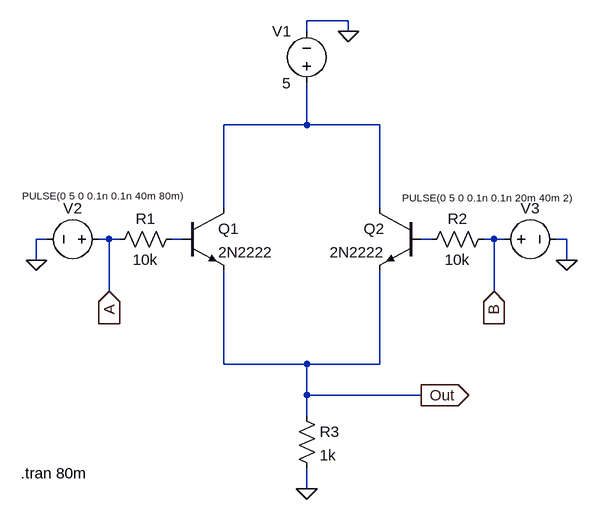
[diagram p0: schematic or_gate.asc]
or_gate.asc, the LTspice schematic file:
Version 4
SHEET 1 1080 680
WIRE 544 -256 480 -256
WIRE 480 -240 480 -256
WIRE 544 -240 544 -256
WIRE 480 -96 480 -160
WIRE 480 -96 352 -96
WIRE 592 -96 480 -96
WIRE 352 32 352 -96
WIRE 592 32 592 -96
WIRE 80 80 64 80
WIRE 176 80 160 80
WIRE 192 80 176 80
WIRE 288 80 272 80
WIRE 672 80 656 80
WIRE 768 80 752 80
WIRE 784 80 768 80
WIRE 880 80 864 80
WIRE 64 112 64 80
WIRE 880 112 880 80
WIRE 176 160 176 80
WIRE 768 160 768 80
WIRE 352 272 352 128
WIRE 480 272 352 272
WIRE 592 272 592 128
WIRE 592 272 480 272
WIRE 480 320 480 272
WIRE 656 320 480 320
WIRE 480 352 480 320
WIRE 480 464 480 432
FLAG 480 464 0
FLAG 544 -240 0
FLAG 64 112 0
FLAG 880 112 0
FLAG 656 320 Out
IOPIN 656 320 Out
FLAG 176 160 A
IOPIN 176 160 In
FLAG 768 160 B
IOPIN 768 160 In
SYMBOL npn 288 32 R0
SYMATTR InstName Q1
SYMATTR Value 2N2222
SYMBOL npn 656 32 M0
SYMATTR InstName Q2
SYMATTR Value 2N2222
SYMBOL voltage 480 -144 R180
WINDOW 0 24 96 Left 2
WINDOW 3 24 16 Left 2
WINDOW 123 0 0 Left 0
WINDOW 39 0 0 Left 0
SYMATTR InstName V1
SYMATTR Value 5
SYMBOL res 288 64 R90
WINDOW 0 0 56 VBottom 2
WINDOW 3 32 56 VTop 2
SYMATTR InstName R1
SYMATTR Value 10k
SYMBOL res 768 64 R90
WINDOW 0 0 56 VBottom 2
WINDOW 3 32 56 VTop 2
SYMATTR InstName R2
SYMATTR Value 10k
SYMBOL voltage 176 80 R90
WINDOW 0 -32 56 VBottom 2
WINDOW 3 -77 12 VTop 1
WINDOW 123 0 0 Left 0
WINDOW 39 0 0 Left 0
SYMATTR InstName V2
SYMATTR Value PULSE(0 5 0 0.1n 0.1n 40m 80m)
SYMBOL voltage 768 80 M90
WINDOW 0 -32 56 VBottom 2
WINDOW 3 -74 -13 VTop 1
WINDOW 123 0 0 Left 0
WINDOW 39 0 0 Left 0
SYMATTR InstName V3
SYMATTR Value PULSE(0 5 0 0.1n 0.1n 20m 40m 2)
SYMBOL res 464 336 R0
SYMATTR InstName R3
SYMATTR Value 1k
TEXT 40 440 Left 2 !.tran 80m

The netlist it stands for:
* or_gate.asc
Q1 N001 N002 Out 0 2N2222
Q2 N001 N003 Out 0 2N2222
V1 N001 0 5
R1 N002 A 10k
R2 B N003 10k
V2 A 0 PULSE(0 5 0 0.1n 0.1n 40m 80m)
V3 B 0 PULSE(0 5 0 0.1n 0.1n 20m 40m 2)
R3 Out 0 1k
.model NPN NPN
.model PNP PNP
.lib standard.bjt
.tran 80m
.backanno
.end